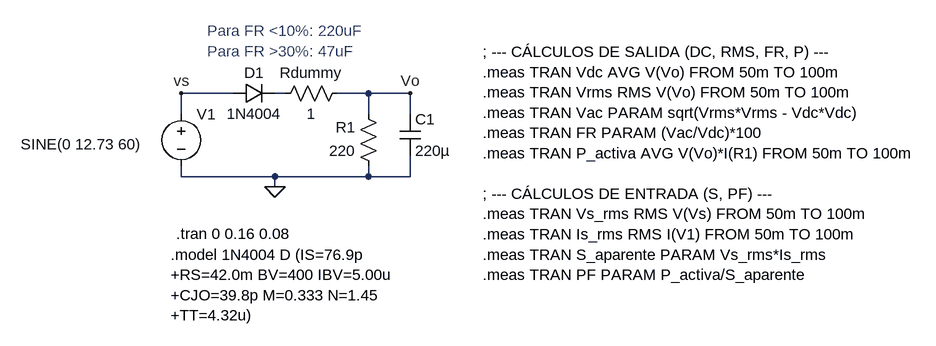
[diagram p0: schematic MediaOnda RC.asc]
MediaOnda RC.asc, the LTspice schematic file:
Version 4.1
SHEET 1 1284 680
WIRE 160 112 80 112
WIRE 240 112 224 112
WIRE 368 112 320 112
WIRE 432 112 368 112
WIRE 80 144 80 112
WIRE 368 144 368 112
WIRE 432 144 432 112
WIRE 80 240 80 224
WIRE 224 240 80 240
WIRE 368 240 368 224
WIRE 368 240 224 240
WIRE 432 240 432 208
WIRE 432 240 368 240
WIRE 224 256 224 240
FLAG 224 256 0
FLAG 432 112 Vo
FLAG 80 112 vs
SYMBOL voltage 80 128 R0
WINDOW 123 0 0 Left 0
WINDOW 39 0 0 Left 0
WINDOW 3 -247 62 Left 2
SYMATTR Value SINE(0 12.73 60)
SYMATTR InstName V1
SYMBOL res 336 96 R90
WINDOW 0 0 56 VBottom 2
WINDOW 3 32 56 VTop 2
SYMATTR InstName Rdummy
SYMATTR Value 1
SYMBOL res 384 240 R180
WINDOW 0 36 76 Left 2
WINDOW 3 36 40 Left 2
SYMATTR InstName R1
SYMATTR Value 220
SYMBOL cap 416 144 R0
SYMATTR InstName C1
SYMATTR Value 220µ
SYMBOL diode 160 128 R270
WINDOW 0 32 32 VTop 2
WINDOW 3 0 32 VBottom 2
SYMATTR InstName D1
SYMATTR Value 1N4004
TEXT 72 328 Left 2 !.tran 0 0.16 0.08
TEXT 64 360 Left 2 !.model 1N4004 D (IS=76.9p \n+RS=42.0m BV=400 IBV=5.00u \n+CJO=39.8p M=0.333 N=1.45 \n+TT=4.32u)
TEXT 120 16 Left 2 ;Para FR <10%: 220uF\nPara FR >30%: 47uF
TEXT 544 48 Left 2 !; --- CÁLCULOS DE SALIDA (DC, RMS, FR, P) ---\n.meas TRAN Vdc AVG V(Vo) FROM 50m TO 100m\n.meas TRAN Vrms RMS V(Vo) FROM 50m TO 100m\n.meas TRAN Vac PARAM sqrt(Vrms*Vrms - Vdc*Vdc)\n.meas TRAN FR PARAM (Vac/Vdc)*100\n.meas TRAN P_activa AVG V(Vo)*I(R1) FROM 50m TO 100m\n \n; --- CÁLCULOS DE ENTRADA (S, PF) ---\n.meas TRAN Vs_rms RMS V(Vs) FROM 50m TO 100m\n.meas TRAN Is_rms RMS I(V1) FROM 50m TO 100m\n.meas TRAN S_aparente PARAM Vs_rms*Is_rms\n.meas TRAN PF PARAM P_activa/S_aparente

The netlist it stands for:
* MediaOnda RC.asc
V1 vs 0 SINE(0 12.73 60)
Rdummy Vo N001 1
R1 0 Vo 220
C1 Vo 0 220µ
D1 vs N001 1N4004
.model D D
.lib standard.dio
.tran 0 0.16 0.08
.model 1N4004 D (IS=76.9p
+RS=42.0m BV=400 IBV=5.00u
+CJO=39.8p M=0.333 N=1.45
+TT=4.32u)
* Para FR <10%: 220uF
* Para FR >30%: 47uF
; --- CÁLCULOS DE SALIDA (DC, RMS, FR, P) ---
.meas TRAN Vdc AVG V(Vo) FROM 50m TO 100m
.meas TRAN Vrms RMS V(Vo) FROM 50m TO 100m
.meas TRAN Vac PARAM sqrt(Vrms*Vrms - Vdc*Vdc)
.meas TRAN FR PARAM (Vac/Vdc)*100
.meas TRAN P_activa AVG V(Vo)*I(R1) FROM 50m TO 100m
; --- CÁLCULOS DE ENTRADA (S, PF) ---
.meas TRAN Vs_rms RMS V(Vs) FROM 50m TO 100m
.meas TRAN Is_rms RMS I(V1) FROM 50m TO 100m
.meas TRAN S_aparente PARAM Vs_rms*Is_rms
.meas TRAN PF PARAM P_activa/S_aparente
.backanno
.end